# EAGLE schematic I2CRJ45X8 (EAGLE 9.6.0)
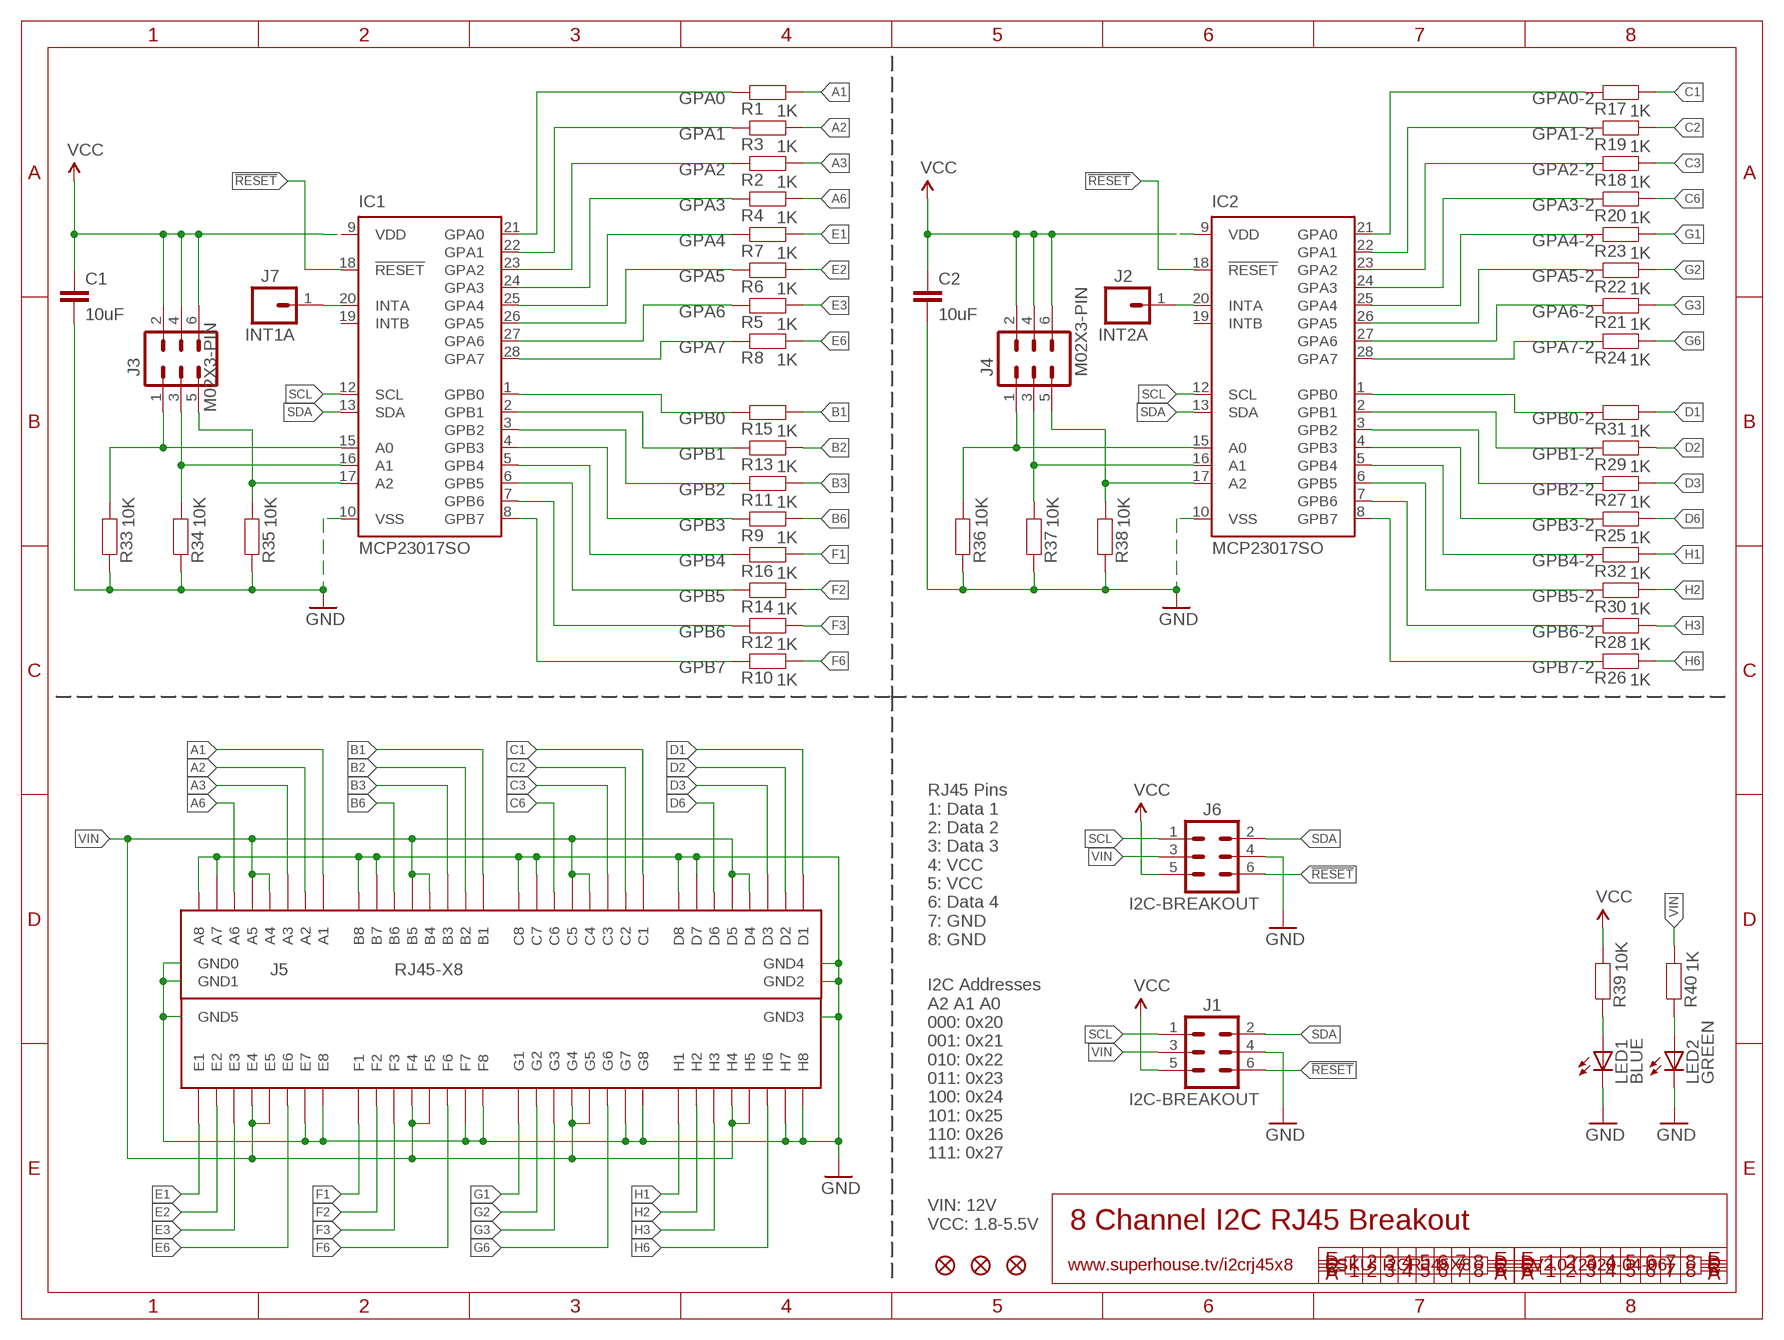
[diagram p0: schematic, sheet 1]

## Parts
C1  10uF  CAP0805  [C0805]
C2  10uF  CAP0805  [C0805]
FID1  FIDUCIAL1X2.5  [FIDUCIAL-1X2.5]
FID2  FIDUCIAL1X2.5  [FIDUCIAL-1X2.5]
FID3  FIDUCIAL1X2.5  [FIDUCIAL-1X2.5]
IC1  MCP23017SO  [SO28W]
IC2  MCP23017SO  [SO28W]
J1  I2C-BREAKOUT  M02X3-SHROUDED  [2X03-SHROUDED]
J2  INT2A  M01-PLAIN  [1X01]
J3  M02X3-PIN  [2X03-P]
J4  M02X3-PIN  [2X03-P]
J5  RJ45-X8  [RJ45-2X4]
J6  I2C-BREAKOUT  M02X3-SHROUDED  [2X03-SHROUDED]
J7  INT1A  M01-PLAIN  [1X01]
LED1  BLUE  LED0603  [LED-0603]
LED2  GREEN  LED0603  [LED-0603]
R1  1K  RESISTOR0603  [R0603]
R2  1K  RESISTOR0603  [R0603]
R3  1K  RESISTOR0603  [R0603]
R4  1K  RESISTOR0603  [R0603]
R5  1K  RESISTOR0603  [R0603]
R6  1K  RESISTOR0603  [R0603]
R7  1K  RESISTOR0603  [R0603]
R8  1K  RESISTOR0603  [R0603]
R9  1K  RESISTOR0603  [R0603]
R10  1K  RESISTOR0603  [R0603]
R11  1K  RESISTOR0603  [R0603]
R12  1K  RESISTOR0603  [R0603]
R13  1K  RESISTOR0603  [R0603]
R14  1K  RESISTOR0603  [R0603]
R15  1K  RESISTOR0603  [R0603]
R16  1K  RESISTOR0603  [R0603]
R17  1K  RESISTOR0603  [R0603]
R18  1K  RESISTOR0603  [R0603]
R19  1K  RESISTOR0603  [R0603]
R20  1K  RESISTOR0603  [R0603]
R21  1K  RESISTOR0603  [R0603]
R22  1K  RESISTOR0603  [R0603]
R23  1K  RESISTOR0603  [R0603]
R24  1K  RESISTOR0603  [R0603]
R25  1K  RESISTOR0603  [R0603]
R26  1K  RESISTOR0603  [R0603]
R27  1K  RESISTOR0603  [R0603]
R28  1K  RESISTOR0603  [R0603]
R29  1K  RESISTOR0603  [R0603]
R30  1K  RESISTOR0603  [R0603]
R31  1K  RESISTOR0603  [R0603]
R32  1K  RESISTOR0603  [R0603]
R33  10K  RESISTOR0603  [R0603]
R34  10K  RESISTOR0603  [R0603]
R35  10K  RESISTOR0603  [R0603]
R36  10K  RESISTOR0603  [R0603]
R37  10K  RESISTOR0603  [R0603]
R38  10K  RESISTOR0603  [R0603]
R39  10K  RESISTOR0603  [R0603]
R40  1K  RESISTOR0603  [R0603]

## Nets
!RESET: IC1.18(!RESET) IC2.18(!RESET) J1.6 J6.6
A1: J5.A1 R1.2
A2: J5.A2 R3.2
A3: J5.A3 R2.2
A6: J5.A6 R4.2
B1: J5.B1 R15.2
B2: J5.B2 R13.2
B3: J5.B3 R11.2
B6: J5.B6 R9.2
C1: J5.C1 R17.2
C2: J5.C2 R19.2
C3: J5.C3 R18.2
C6: J5.C6 R20.2
D1: J5.D1 R31.2
D2: J5.D2 R29.2
D3: J5.D3 R27.2
D6: J5.D6 R25.2
E1: J5.E1 R7.2
E2: J5.E2 R6.2
E3: J5.E3 R5.2
E6: J5.E6 R8.2
F1: J5.F1 R16.2
F2: J5.F2 R14.2
F3: J5.F3 R12.2
F6: J5.F6 R10.2
G1: J5.G1 R23.2
G2: J5.G2 R22.2
G3: J5.G3 R21.2
G6: J5.G6 R24.2
GND: C1.2 C2.2 IC1.10(VSS) IC2.10(VSS) J1.4 J5.A7 J5.A8 J5.B7 J5.B8 J5.C7 J5.C8 J5.D7 J5.D8 J5.E7 J5.E8 J5.F7 J5.F8 J5.G7 J5.G8 J5.GND0 J5.GND1 J5.GND2 J5.GND3 J5.GND4 J5.GND5 J5.H7 J5.H8 J6.4 LED1.C LED2.C R33.1 R34.1 R35.1 R36.1 R37.1 R38.1
GPA0: IC1.21(GPA0) R1.1
GPA0-2: IC2.21(GPA0) R17.1
GPA1: IC1.22(GPA1) R3.1
GPA1-2: IC2.22(GPA1) R19.1
GPA2: IC1.23(GPA2) R2.1
GPA2-2: IC2.23(GPA2) R18.1
GPA3: IC1.24(GPA3) R4.1
GPA3-2: IC2.24(GPA3) R20.1
GPA4: IC1.25(GPA4) R7.1
GPA4-2: IC2.25(GPA4) R23.1
GPA5: IC1.26(GPA5) R6.1
GPA5-2: IC2.26(GPA5) R22.1
GPA6: IC1.27(GPA6) R5.1
GPA6-2: IC2.27(GPA6) R21.1
GPA7: IC1.28(GPA7) R8.1
GPA7-2: IC2.28(GPA7) R24.1
GPB0: IC1.1(GPB0) R15.1
GPB0-2: IC2.1(GPB0) R31.1
GPB1: IC1.2(GPB1) R13.1
GPB1-2: IC2.2(GPB1) R29.1
GPB2: IC1.3(GPB2) R11.1
GPB2-2: IC2.3(GPB2) R27.1
GPB3: IC1.4(GPB3) R9.1
GPB3-2: IC2.4(GPB3) R25.1
GPB4: IC1.5(GPB4) R16.1
GPB4-2: IC2.5(GPB4) R32.1
GPB5: IC1.6(GPB5) R14.1
GPB5-2: IC2.6(GPB5) R30.1
GPB6: IC1.7(GPB6) R12.1
GPB6-2: IC2.7(GPB6) R28.1
GPB7: IC1.8(GPB7) R10.1
GPB7-2: IC2.8(GPB7) R26.1
H1: J5.H1 R32.2
H2: J5.H2 R30.2
H3: J5.H3 R28.2
H6: J5.H6 R26.2
N$1: IC2.16(A1) J4.3 R37.2
N$2: IC1.17(A2) J3.5 R35.2
N$3: IC1.16(A1) J3.3 R34.2
N$4: IC1.15(A0) J3.1 R33.2
N$5: IC2.15(A0) J4.1 R36.2
N$6: IC2.17(A2) J4.5 R38.2
N$7: LED1.A R39.1
N$8: LED2.A R40.1
N$9: IC2.20(INTA) J2.1
N$10: IC1.20(INTA) J7.1
SCL: IC1.12(SCL) IC2.12(SCL) J1.1 J6.1
SDA: IC1.13(SDA) IC2.13(SDA) J1.2 J6.2
VCC: C1.1 C2.1 IC1.9(VDD) IC2.9(VDD) J1.5 J3.2 J3.4 J3.6 J4.2 J4.4 J4.6 J6.5 R39.2
VIN: J1.3 J5.A4 J5.A5 J5.B4 J5.B5 J5.C4 J5.C5 J5.D4 J5.D5 J5.E4 J5.E5 J5.F4 J5.F5 J5.G4 J5.G5 J5.H4 J5.H5 J6.3 R40.2
Unconnected: IC1.19(INTB) IC2.19(INTB)

## Notes on the sheet
- RJ45 Pins
  1: Data 1
  2: Data 2
  3: Data 3
  4: VCC
  5: VCC
  6: Data 4
  7: GND
  8: GND
- I2C Addresses
  A2 A1 A0
  000: 0x20
  001: 0x21
  010: 0x22
  011: 0x23
  100: 0x24
  101: 0x25
  110: 0x26
  111: 0x27
- VIN: 12V
  VCC: 1.8-5.5V
- 8 Channel I2C RJ45 Breakout
- www.superhouse.tv/i2crj45x8 | SKU: I2CRJ45X8 | V2.0 (2020-04-06)

## Library data of the parts
C1 C2 = SuperHouse-DiscreteSemi:CAP: Capacitor Standard ceramic capacitor
FID1-FID3 = SuperHouse-Symbols:FIDUCIAL: Fiducial Alignment Points Various fiducial points for machine vision alignment.
IC1 IC2 = SuperHouse-ICs:MCP23017: http://ww1.microchip.com/downloads/en/DeviceDoc/21952a.pdf Source: http://ww1.microchip.com/downloads/en/DeviceDoc/21952a.pdf
J1 J3 J4 J6 = SuperHouse-Connectors:M02X3: 0.1" header, 2x3 (6-way)
J2 J7 = SuperHouse-Connectors:M01: 1-way header Standard 1x1 header
J5 = SuperHouse-Connectors:RJ45-X8: 8-way RJ45 socket, PCB mount. 2 rows of 4.
LED1 LED2 = SuperHouse-LEDs:LED: LEDs Standard schematic elements and footprints for 5mm, 3mm, 1206, and 0603 sized LEDs. 5mm - Spark Fun Electronics SKU : COM-00529 (and others)
R1-R40 = SuperHouse-DiscreteSemi:RESISTOR: Resistor Standard resistors.